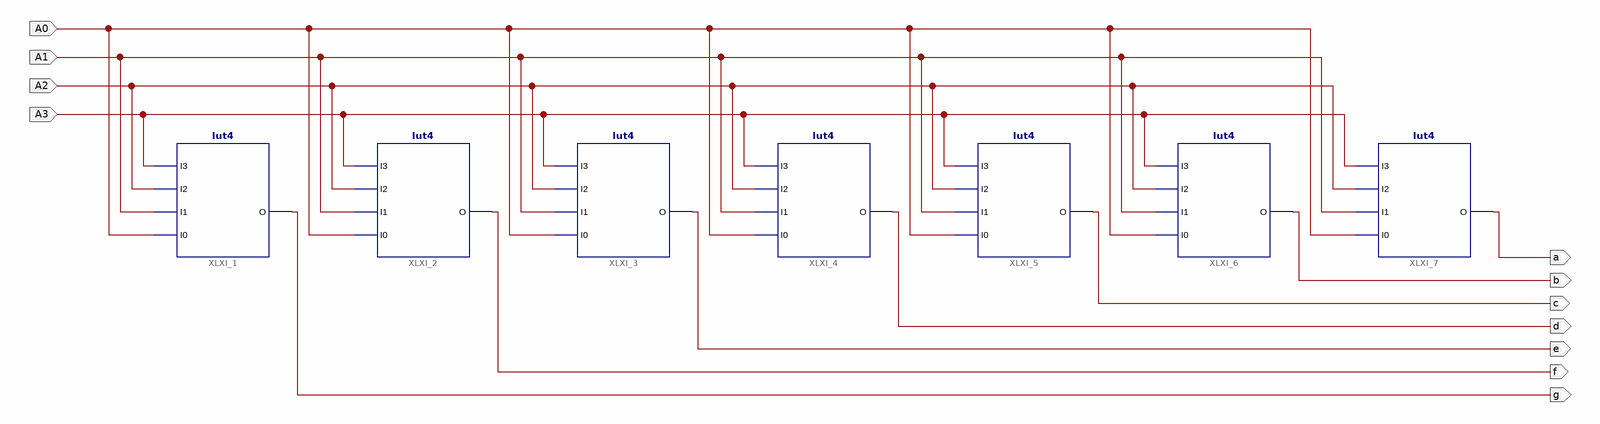
[diagram p0: schematic sheet 1]
// Xilinx ISE schematic ssd1d0ft.sch (spartan6) as structural Verilog: 7 symbols, 11 ports
module ssd1d0ft (
  input  A0,
  input  A1,
  input  A2,
  input  A3,
  output a,
  output b,
  output c,
  output d,
  output e,
  output f,
  output g
);

  lut4 #(.INIT("EF7C")) XLXI_1 (.I0(A0), .I1(A1), .I2(A2), .I3(A3), .O(g));
  lut4 #(.INIT("DF71")) XLXI_2 (.I0(A0), .I1(A1), .I2(A2), .I3(A3), .O(f));
  lut4 #(.INIT("FD45")) XLXI_3 (.I0(A0), .I1(A1), .I2(A2), .I3(A3), .O(e));
  lut4 #(.INIT("7B6D")) XLXI_4 (.I0(A0), .I1(A1), .I2(A2), .I3(A3), .O(d));
  lut4 #(.INIT("2FFB")) XLXI_5 (.I0(A0), .I1(A1), .I2(A2), .I3(A3), .O(c));
  lut4 #(.INIT("279F")) XLXI_6 (.I0(A0), .I1(A1), .I2(A2), .I3(A3), .O(b));
  lut4 #(.INIT("D7ED")) XLXI_7 (.I0(A0), .I1(A1), .I2(A2), .I3(A3), .O(a));
endmodule
